# Altium schematic sheet NRF24L01.SchDoc
size A4
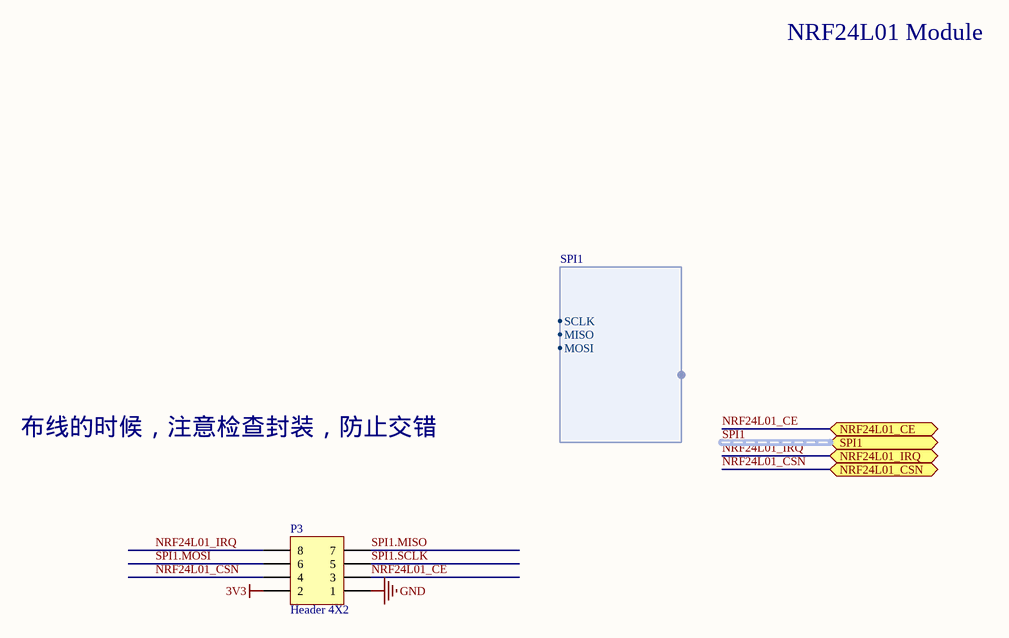
[diagram p0: NRF24L01.SchDoc]

## Parts
P3  Header 4X2  [NRF24L01 MODULE]

## Ports
NRF24L01_CE, NRF24L01_CSN, NRF24L01_IRQ, SPI1 (harness SPI1)

## Harnesses
SPI1: SCLK, MISO, MOSI

## Nets
3V3: P3.2
GND: P3.1
NRF24L01_CE: P3.3 ; port NRF24L01_CE
NRF24L01_CSN: P3.4 ; port NRF24L01_CSN
NRF24L01_IRQ: P3.8 ; port NRF24L01_IRQ
SPI1.MISO: P3.7
SPI1.MOSI: P3.6
SPI1.SCLK: P3.5

## Buses and harness runs
harness SPI1 = port SPI1

## Notes on the sheet
- NRF24L01 Module
- 布线的时候，注意检查封装，防止交错

## Library data of the parts
P3 = Header 4X2: Header, 4-Pin, Dual row; LatestRevisionDate: 17-Jul-2002; LatestRevisionNote: Re-released for DXP Platform.; Publisher: Altium Limited